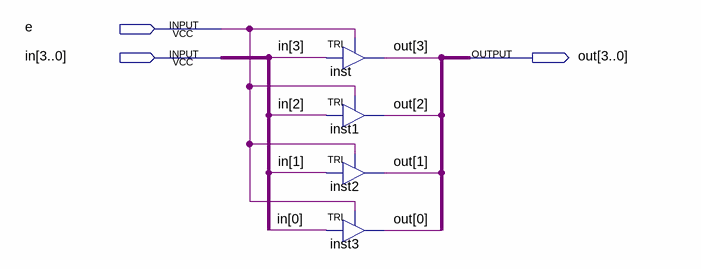
[diagram p0: schematic sheet]
// Quartus schematic bus_tristate.bdf as structural Verilog: 4 symbols, 3 pins
module bus_tristate (
  input  e,
  input  [3:0] in,
  output [3:0] out
);

  TRI inst (.IN(in[3]), .OE(e), .OUT(out[3]));
  TRI inst1 (.IN(in[2]), .OE(e), .OUT(out[2]));
  TRI inst2 (.IN(in[1]), .OE(e), .OUT(out[1]));
  TRI inst3 (.IN(in[0]), .OE(e), .OUT(out[0]));
endmodule
